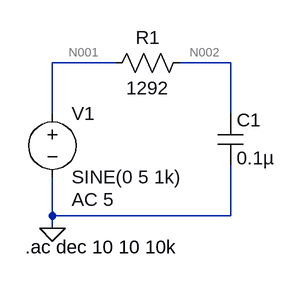
[diagram p0: schematic PL2.asc]
PL2.asc, the LTspice schematic file:
Version 4
SHEET 1 880 680
WIRE 288 80 208 80
WIRE 432 80 368 80
WIRE 208 144 208 80
WIRE 432 144 432 80
WIRE 208 272 208 224
WIRE 432 272 432 208
WIRE 432 272 208 272
WIRE 208 288 208 272
FLAG 208 288 0
SYMBOL voltage 208 128 R0
WINDOW 123 24 124 Left 2
WINDOW 39 0 0 Left 2
SYMATTR InstName V1
SYMATTR Value SINE(0 5 1k)
SYMATTR Value2 AC 5
SYMBOL res 384 64 R90
WINDOW 0 0 56 VBottom 2
WINDOW 3 32 56 VTop 2
SYMATTR InstName R1
SYMATTR Value 1292
SYMBOL cap 416 144 R0
SYMATTR InstName C1
SYMATTR Value 0.1µ
TEXT 174 312 Left 2 !.ac dec 10 10 10k

The netlist it stands for:
* PL2.asc
V1 N001 0 SINE(0 5 1k) AC 5
R1 N002 N001 1292
C1 N002 0 0.1µ
.ac dec 10 10 10k
.backanno
.end

* Results of the author's LTspice run, read from the files saved beside the schematic
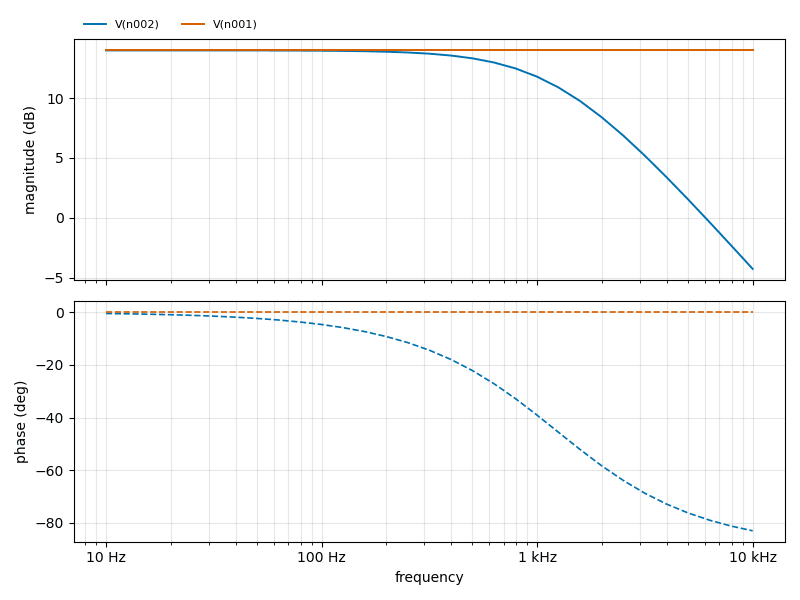
[diagram p1: AC Analysis of PL2.asc, plotted from the saved traces]
* AC Analysis, 1 run:
*   V(n002): 13.98 dB at 10 Hz, -4.27 dB at 10 kHz, peak 13.98 dB at 10 Hz, 3 dB below the peak at 1.229 kHz
*   V(n001): 13.98 dB at 10 Hz, 13.98 dB at 10 kHz, peak 13.98 dB at 10 Hz